# Altium schematic sheet Anahtarlamasemasi.SchDoc
size A4
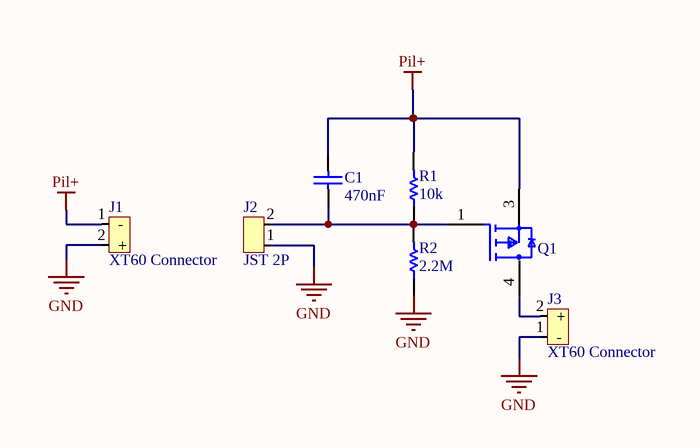
[diagram p0: Anahtarlamasemasi.SchDoc]

## Parts
C1  value 470nF  [CAP0805]  (hidden comment: Cap)
J1  XT60 Connector  [XT60_H]
J2  JST 2P  [JST_Horizontal]
J3  XT60 Connector  [XT60_H]
Q1  SUD50P04-08-GE3  [Vishay_T16-0236_MFG]  (value not drawn)
R1  value 10k  [RES0805]  (hidden comment: Res1)
R2  value 2.2M  [RES0805]  (hidden comment: Res1)

## Nets
GND: J1.2(+) J2.1 J3.1(-) R2.1
Pil+: C1.2 J1.1(-) Q1.3(S) R1.2
NetC1_1: C1.1 J2.2 Q1.1(G) R1.1 R2.2
NetJ3_2: J3.2(+) Q1.4(D)

## Library data of the parts
C1 = Cap: Capacitor; Published: 8-Jun-2000; LatestRevisionDate: 17-Jul-2002; LatestRevisionNote: Re-released for DXP Platform.; PackageReference: RAD-0.3; Publisher: Altium Limited; PackageDescription: Radial Cap, Thru-Hole; 2 Leads; 0.3 in Pin Spacing
J1 J3 = XT60
J2 = JST
R1 R2 = Res1: Resistor; Published: 8-Jun-2000; LatestRevisionDate: 17-Jul-2002; LatestRevisionNote: Re-released for DXP Platform.; PackageReference: AXIAL-0.3; Publisher: Altium Limited; PackageDescription: Axial Device, Thru-Hole; 2 Leads; 0.3 in Pin Spacing